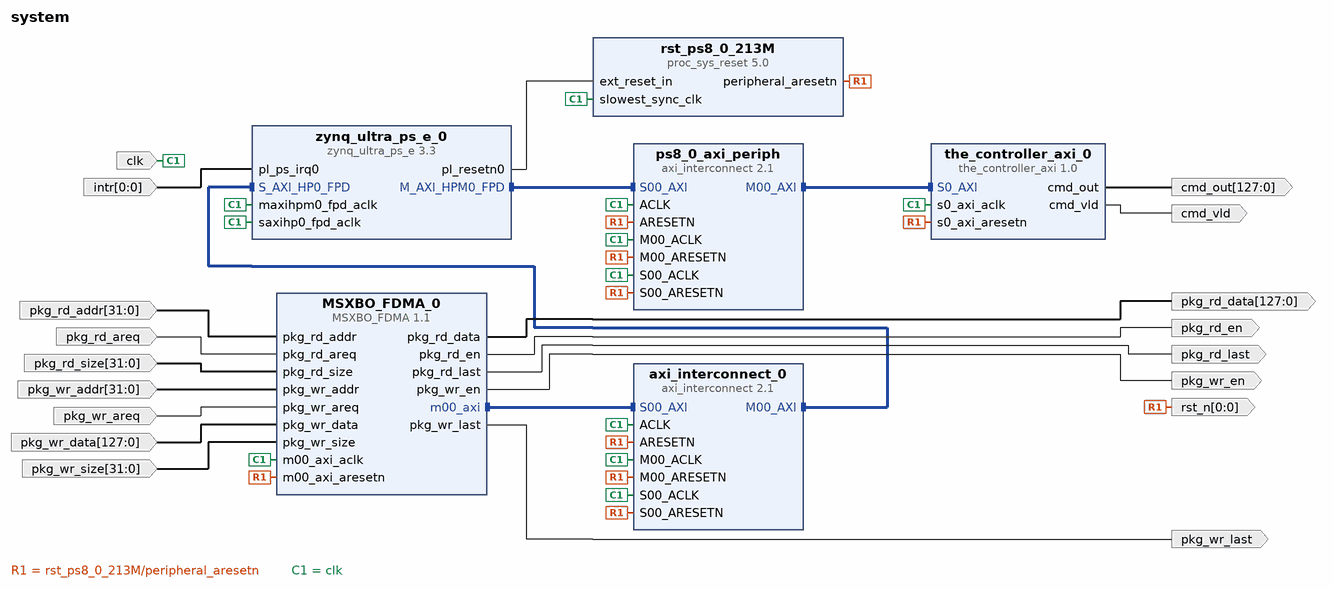
[diagram p0: block diagram of the top level]
# Vivado block design system, xczu3eg-sbva484-2-i, Vivado 2021.1
create_bd_design system

create_bd_port -dir O pkg_wr_en
create_bd_port -dir I -from 31 -to 0 pkg_rd_size
create_bd_port -dir I -from 31 -to 0 pkg_rd_addr
create_bd_port -dir O pkg_wr_last
create_bd_port -dir O -from 127 -to 0 pkg_rd_data
create_bd_port -dir I pkg_wr_areq
create_bd_port -dir O pkg_rd_last
create_bd_port -dir I pkg_rd_areq
create_bd_port -dir I -from 31 -to 0 pkg_wr_size
create_bd_port -dir I -from 31 -to 0 pkg_wr_addr
create_bd_port -dir O pkg_rd_en
create_bd_port -dir O -from 0 -to 0 rst_n
create_bd_port -dir I -type clk clk
set_property -dict {CONFIG.FREQ_HZ 200000000} [get_bd_ports clk]
create_bd_port -dir I -from 127 -to 0 pkg_wr_data
create_bd_port -dir I -from 0 -to 0 -type intr intr
set_property -dict {CONFIG.PortWidth 1} [get_bd_ports intr]
create_bd_port -dir O cmd_vld
create_bd_port -dir O -from 127 -to 0 cmd_out

create_bd_cell -type ip -vlnv xilinx.com:ip:zynq_ultra_ps_e:3.3 zynq_ultra_ps_e_0
set_property -dict [list \
  CONFIG.PSU__CRF_APB__ACPU_CTRL__FREQMHZ 1200 \
  CONFIG.PSU__CRF_APB__DDR_CTRL__FREQMHZ 533 \
  CONFIG.PSU__CRF_APB__GPU_REF_CTRL__SRCSEL VPLL \
  CONFIG.PSU__DDRC__BUS_WIDTH {32 Bit} \
  CONFIG.PSU__DDRC__DEVICE_CAPACITY {16384 MBits} \
  CONFIG.PSU__DDRC__DRAM_WIDTH {32 Bits} \
  CONFIG.PSU__DDRC__ECC Disabled \
  CONFIG.PSU__DDRC__MEMORY_TYPE {LPDDR 4} \
  CONFIG.PSU__DDRC__SPEED_BIN LPDDR4_1066 \
  CONFIG.PSU__DDR_HIGH_ADDRESS_GUI_ENABLE 0 \
  CONFIG.PSU__DDR__INTERFACE__FREQMHZ 266.500 \
  CONFIG.PSU__DLL__ISUSED 1 \
  CONFIG.PSU__FPGA_PL0_ENABLE 0 \
  CONFIG.PSU__MAXIGP0__DATA_WIDTH 128 \
  CONFIG.PSU__OVERRIDE__BASIC_CLOCK 1 \
  CONFIG.PSU__SD0__DATA_TRANSFER_MODE 4Bit \
  CONFIG.PSU__SD0__GRP_CD__ENABLE 1 \
  CONFIG.PSU__SD0__GRP_CD__IO {MIO 24} \
  CONFIG.PSU__SD0__PERIPHERAL__ENABLE 1 \
  CONFIG.PSU__SD0__PERIPHERAL__IO {MIO 13 .. 16 21 22} \
  CONFIG.PSU__SD0__SLOT_TYPE {SD 2.0} \
  CONFIG.PSU__UART0__BAUD_RATE 115200 \
  CONFIG.PSU__UART0__MODEM__ENABLE 0 \
  CONFIG.PSU__UART0__PERIPHERAL__ENABLE 1 \
  CONFIG.PSU__UART0__PERIPHERAL__IO {MIO 34 .. 35} \
  CONFIG.PSU__USE__IRQ0 1 \
  CONFIG.PSU__USE__M_AXI_GP0 1 \
  CONFIG.PSU__USE__M_AXI_GP2 0 \
  CONFIG.PSU__USE__S_AXI_GP2 1 \
] [get_bd_cells zynq_ultra_ps_e_0]
# 157 more settings of zynq_ultra_ps_e_0 are not shown: defaults, MIO pin electricals, DDR timing, and values the tool derives
create_bd_cell -type ip -vlnv xilinx.com:user:MSXBO_FDMA:1.1 MSXBO_FDMA_0
set_property -dict [list \
  CONFIG.C_M00_AXI_BURST_LEN 4 \
  CONFIG.C_M00_AXI_DATA_WIDTH 128 \
  CONFIG.C_M00_AXI_ID 1 \
] [get_bd_cells MSXBO_FDMA_0]
create_bd_cell -type ip -vlnv xilinx.com:ip:axi_interconnect:2.1 axi_interconnect_0
set_property -dict {CONFIG.NUM_MI 1} [get_bd_cells axi_interconnect_0]
create_bd_cell -type ip -vlnv xilinx.com:ip:proc_sys_reset:5.0 rst_ps8_0_213M
create_bd_cell -type ip -vlnv xilinx.com:user:the_controller_axi:1.0 the_controller_axi_0
create_bd_cell -type ip -vlnv xilinx.com:ip:axi_interconnect:2.1 ps8_0_axi_periph
set_property -dict {CONFIG.NUM_MI 1} [get_bd_cells ps8_0_axi_periph]

# ---- connections ----

connect_bd_intf_net [get_bd_intf_pins MSXBO_FDMA_0/m00_axi] [get_bd_intf_pins axi_interconnect_0/S00_AXI]
connect_bd_intf_net [get_bd_intf_pins axi_interconnect_0/M00_AXI] [get_bd_intf_pins zynq_ultra_ps_e_0/S_AXI_HP0_FPD]
connect_bd_intf_net [get_bd_intf_pins ps8_0_axi_periph/M00_AXI] [get_bd_intf_pins the_controller_axi_0/S0_AXI]
connect_bd_intf_net [get_bd_intf_pins zynq_ultra_ps_e_0/M_AXI_HPM0_FPD] [get_bd_intf_pins ps8_0_axi_periph/S00_AXI]
connect_bd_net [get_bd_pins MSXBO_FDMA_0/pkg_rd_data] [get_bd_ports pkg_rd_data]
connect_bd_net [get_bd_pins MSXBO_FDMA_0/pkg_rd_en] [get_bd_ports pkg_rd_en]
connect_bd_net [get_bd_pins MSXBO_FDMA_0/pkg_rd_last] [get_bd_ports pkg_rd_last]
connect_bd_net [get_bd_pins MSXBO_FDMA_0/pkg_wr_en] [get_bd_ports pkg_wr_en]
connect_bd_net [get_bd_pins MSXBO_FDMA_0/pkg_wr_last] [get_bd_ports pkg_wr_last]
connect_bd_net -net pkg_rd_addr_0_1 [get_bd_ports pkg_rd_addr] [get_bd_pins MSXBO_FDMA_0/pkg_rd_addr]
connect_bd_net -net pkg_rd_areq_0_1 [get_bd_ports pkg_rd_areq] [get_bd_pins MSXBO_FDMA_0/pkg_rd_areq]
connect_bd_net -net pkg_rd_size_0_1 [get_bd_ports pkg_rd_size] [get_bd_pins MSXBO_FDMA_0/pkg_rd_size]
connect_bd_net -net pkg_wr_addr_0_1 [get_bd_ports pkg_wr_addr] [get_bd_pins MSXBO_FDMA_0/pkg_wr_addr]
connect_bd_net -net pkg_wr_areq_0_1 [get_bd_ports pkg_wr_areq] [get_bd_pins MSXBO_FDMA_0/pkg_wr_areq]
connect_bd_net -net pkg_wr_data_0_1 [get_bd_ports pkg_wr_data] [get_bd_pins MSXBO_FDMA_0/pkg_wr_data]
connect_bd_net -net pkg_wr_size_0_1 [get_bd_ports pkg_wr_size] [get_bd_pins MSXBO_FDMA_0/pkg_wr_size]
connect_bd_net -net pl_ps_irq0_0_1 [get_bd_ports intr] [get_bd_pins zynq_ultra_ps_e_0/pl_ps_irq0]
connect_bd_net [get_bd_pins rst_ps8_0_213M/peripheral_aresetn] \
  [get_bd_pins axi_interconnect_0/ARESETN] [get_bd_pins MSXBO_FDMA_0/m00_axi_aresetn] \
  [get_bd_pins axi_interconnect_0/S00_ARESETN] [get_bd_pins axi_interconnect_0/M00_ARESETN] [get_bd_ports rst_n] \
  [get_bd_pins ps8_0_axi_periph/S00_ARESETN] [get_bd_pins the_controller_axi_0/s0_axi_aresetn] \
  [get_bd_pins ps8_0_axi_periph/M00_ARESETN] [get_bd_pins ps8_0_axi_periph/ARESETN]
connect_bd_net [get_bd_pins the_controller_axi_0/cmd_out] [get_bd_ports cmd_out]
connect_bd_net [get_bd_pins the_controller_axi_0/cmd_vld] [get_bd_ports cmd_vld]
connect_bd_net -net zynq_ultra_ps_e_0_pl_clk0 [get_bd_ports clk] \
  [get_bd_pins MSXBO_FDMA_0/m00_axi_aclk] [get_bd_pins zynq_ultra_ps_e_0/saxihp0_fpd_aclk] \
  [get_bd_pins axi_interconnect_0/ACLK] [get_bd_pins rst_ps8_0_213M/slowest_sync_clk] \
  [get_bd_pins axi_interconnect_0/S00_ACLK] [get_bd_pins axi_interconnect_0/M00_ACLK] \
  [get_bd_pins zynq_ultra_ps_e_0/maxihpm0_fpd_aclk] [get_bd_pins ps8_0_axi_periph/S00_ACLK] \
  [get_bd_pins the_controller_axi_0/s0_axi_aclk] [get_bd_pins ps8_0_axi_periph/M00_ACLK] [get_bd_pins ps8_0_axi_periph/ACLK]
connect_bd_net [get_bd_pins zynq_ultra_ps_e_0/pl_resetn0] [get_bd_pins rst_ps8_0_213M/ext_reset_in]

# ---- address map ----
assign_bd_address -offset 0x00000000 -range 1G -target_address_space [get_bd_addr_spaces MSXBO_FDMA_0/m00_axi] [get_bd_addr_segs zynq_ultra_ps_e_0/SAXIGP2/HP0_DDR_LOW]
assign_bd_address -offset 0xFF000000 -range 16M -target_address_space [get_bd_addr_spaces MSXBO_FDMA_0/m00_axi] [get_bd_addr_segs zynq_ultra_ps_e_0/SAXIGP2/HP0_LPS_OCM]
assign_bd_address -offset 0x00A0000000 -range 64K -target_address_space [get_bd_addr_spaces zynq_ultra_ps_e_0/Data] [get_bd_addr_segs the_controller_axi_0/S0_AXI/S0_AXI_reg]

validate_bd_design
save_bd_design
